# Altium schematic sheet IO.SchDoc
size A3; SheetNumber: 7; SheetTotal: 8
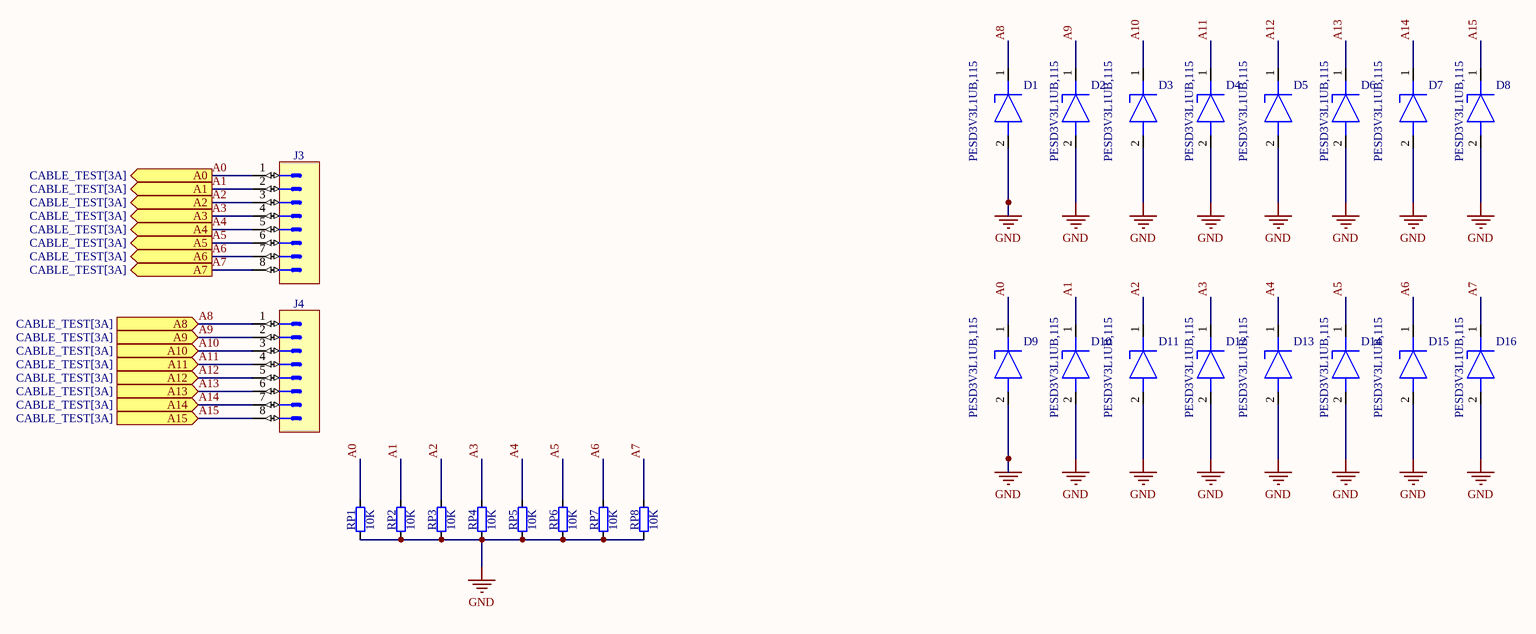
[diagram p0: IO.SchDoc]

## Parts
D1  PESD3V3L1UB,115  [SODFL1608X65N]
D2  PESD3V3L1UB,115  [SODFL1608X65N]
D3  PESD3V3L1UB,115  [SODFL1608X65N]
D4  PESD3V3L1UB,115  [SODFL1608X65N]
D5  PESD3V3L1UB,115  [SODFL1608X65N]
D6  PESD3V3L1UB,115  [SODFL1608X65N]
D7  PESD3V3L1UB,115  [SODFL1608X65N]
D8  PESD3V3L1UB,115  [SODFL1608X65N]
D9  PESD3V3L1UB,115  [SODFL1608X65N]
D10  PESD3V3L1UB,115  [SODFL1608X65N]
D11  PESD3V3L1UB,115  [SODFL1608X65N]
D12  PESD3V3L1UB,115  [SODFL1608X65N]
D13  PESD3V3L1UB,115  [SODFL1608X65N]
D14  PESD3V3L1UB,115  [SODFL1608X65N]
D15  PESD3V3L1UB,115  [SODFL1608X65N]
D16  PESD3V3L1UB,115  [SODFL1608X65N]
J3  (no value)  [PHOENIX_1757307]
J4  (no value)  [PHOENIX_1757307]
RP1  10K  [RESC2012X60N]
RP2  10K  [RESC2012X60N]
RP3  10K  [RESC2012X60N]
RP4  10K  [RESC2012X60N]
RP5  10K  [RESC2012X60N]
RP6  10K  [RESC2012X60N]
RP7  10K  [RESC2012X60N]
RP8  10K  [RESC2012X60N]

## Ports
A0 (out, see CABLE_TEST[3A]), A1 (out, see CABLE_TEST[3A]), A2 (out, see CABLE_TEST[3A]), A3 (out, see CABLE_TEST[3A]), A4 (out, see CABLE_TEST[3A]), A5 (out, see CABLE_TEST[3A]), A6 (out, see CABLE_TEST[3A]), A7 (out, see CABLE_TEST[3A]), A8 (in, see CABLE_TEST[3A]), A9 (in, see CABLE_TEST[3A]), A10 (in, see CABLE_TEST[3A]), A11 (in, see CABLE_TEST[3A]), A12 (in, see CABLE_TEST[3A]), A13 (in, see CABLE_TEST[3A]), A14 (in, see CABLE_TEST[3A]), A15 (in, see CABLE_TEST[3A])

## Nets
GND: D1.2(A) D2.2(A) D3.2(A) D4.2(A) D5.2(A) D6.2(A) D7.2(A) D8.2(A) D9.2(A) D10.2(A) D11.2(A) D12.2(A) D13.2(A) D14.2(A) D15.2(A) D16.2(A) RP1.1 RP2.1 RP3.1 RP4.1 RP5.1 RP6.1 RP7.1 RP8.1
A0: D9.1(K) J3.1 RP1.2 ; port A0
A1: D10.1(K) J3.2 RP2.2 ; port A1
A2: D11.1(K) J3.3 RP3.2 ; port A2
A3: D12.1(K) J3.4 RP4.2 ; port A3
A4: D13.1(K) J3.5 RP5.2 ; port A4
A5: D14.1(K) J3.6 RP6.2 ; port A5
A6: D15.1(K) J3.7 RP7.2 ; port A6
A7: D16.1(K) J3.8 RP8.2 ; port A7
A8: D1.1(K) J4.1 ; port A8
A9: D2.1(K) J4.2 ; port A9
A10: D3.1(K) J4.3 ; port A10
A11: D4.1(K) J4.4 ; port A11
A12: D5.1(K) J4.5 ; port A12
A13: D6.1(K) J4.6 ; port A13
A14: D7.1(K) J4.7 ; port A14
A15: D8.1(K) J4.8 ; port A15

## Library data of the parts
D1-D16 = PESD3V3L1UB,115: Diode ESD (Uni-directional); Manufacturer_Name: Nexperia; Datasheet Link: https://assets.nexperia.com/documents/data-sheet/PESD3V3L1UB.pdf; Height: 0.65mm; Manufacturer_Part_Number: PESD3V3L1UB,115; Mouser Part Number: 771-PESD3V3L1UB115; Mouser Price/Stock: https://www.mouser.co.uk/ProductDetail/Nexperia/PESD3V3L1UB115?qs=LMSg3oBIm%2Fjt%252BUjwy43%2Fgg%3D%3D; Arrow Part Number: PESD3V3L1UB,115; Arrow Price/Stock: https://www.arrow.com/en/products/pesd3v3l1ub115/nexperia?region=nac
J3 J4 = PHOENIX_1757307: Connector 8 Male; Part Description: 12A, 250V, Pitch 5.08mm, 8 Positions Header; Manufacturer: PHOENIX CONTACT; Manufacturer Part Number: 1757307 (MSTBA 2,5/ 8-G-5,08); PressFit: No; Part Number: PHOENIX_1757307; Component Kind: Standard; Component Type: Standard; Pin Count: 8; Mounted: Yes; Socket: No; SMD: No; Sense: No; Status: None; ComponentHeight: 8.6mm; HelpURL: \\cern.ch\dfs\Applications\Altium\Datasheets\PHOENIX_1757307.pdf; Author: CERN DEM JLC; CreateDate: 2/10/2010; LatestRevisionDate: 4/26/2010
RP1-RP8 = R0805_24K_1%_0.125W_100PPM: Resistor - 1%; Part Description: General Purpose Thick Film Chip Resistor; Manufacturer: GENERIC; Manufacturer1 Part Number: NRC10F2402TRF; Power: 0.125W; TC: ±100ppm/°C; PressFit: No; Part Number: R0805_24K_1%_0.125W_100PPM; Component Kind: Standard; Component Type: Standard; Pin Count: 2; Value: 10K; Status: Preferred; Tolerance: ±1%; Manufacturer Part Number: R0805_24K_1%_0.125W_100PPM; Case: 0805; Mounted: Yes; Sense: No; Socket: No; SMD: Yes; HelpURL: \\cern.ch\dfs\Applications\Altium\Datasheets\R0805_NIC_NRC.pdf; Author: CERN DEM JLC; CreateDate: 12/3/2007; LatestRevisionDate: 3/13/2008; Manufacturer1 Example: NIC COMPONENT; Manufacturer1 ComponentHeight: 0.6mm